# EAGLE design jha_sensor (EAGLE 6.2)
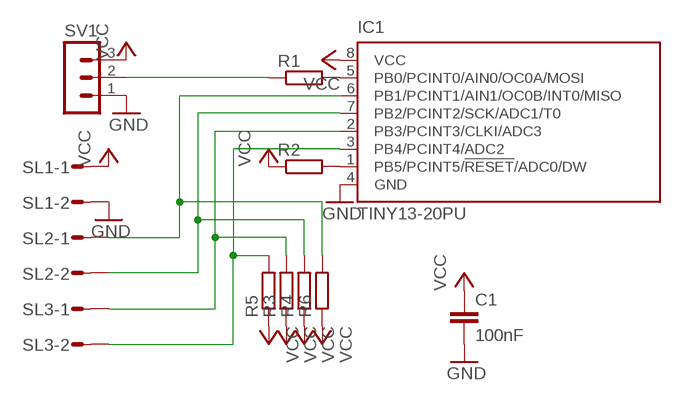
[diagram p0: schematic, sheet 1]

## Parts
C1  100nF  C-EUC0603  [C0603]
IC1  TINY13-20PU  [DIL08]
R1  R-EU_R0805  [R0805]
R2  R-EU_R0805  [R0805]
R3  R-EU_R0805  [R0805]
R4  R-EU_R0805  [R0805]
R5  R-EU_R0805  [R0805]
R6  R-EU_R0805  [R0805]
SL1  MA02S  [02PA]
SL2  MA02S  [02PA]
SL3  MA02S  [02PA]
SV1  MA03-1  [MA03-1]

## Nets
GND: C1.2 IC1.4(GND) SL1.2 SV1.1
N$1: IC1.5(PB0/PCINT0/AIN0/OC0A/MOSI) R1.2
N$2: R1.1 SV1.2
N$3: IC1.1(PB5/PCINT5/!RESET!/ADC0/DW) R2.2
N$4: IC1.2(PB3/PCINT3/CLKI/ADC3) R3.2 SL3.1
N$5: IC1.7(PB2/PCINT2/SCK/ADC1/T0) R4.2 SL2.2
N$6: IC1.6(PB1/PCINT1/AIN1/OC0B/INT0/MISO) R6.2 SL2.1
N$10: IC1.3(PB4/PCINT4/ADC2) R5.2 SL3.2
VCC: C1.1 IC1.8(VCC) R2.1 R3.1 R4.1 R5.1 R6.1 SL1.1 SV1.3

## Library data of the parts
C1 = rcl:C-EU: CAPACITOR, European symbol
IC1 = atmel:TINY13: 8-bit AVR Microcontroller with 1K Bytes In-System Programmable Flash Source: http://www.atmel.com/dyn/resources/prod_documents/2535S.pdf; MPN: ATTINY13-20PU; OC_FARNELL: 9171550; OC_NEWARK: 96K6521
R1-R6 = rcl:R-EU_: RESISTOR, European symbol
SL1-SL3 = con-amp-quick:MA02S: AMP QUICK CONNECTOR; OC_FARNELL: unknown; OC_NEWARK: unknown
SV1 = con-lstb:MA03-1: PIN HEADER; OC_FARNELL: unknown; OC_NEWARK: unknown

## Board
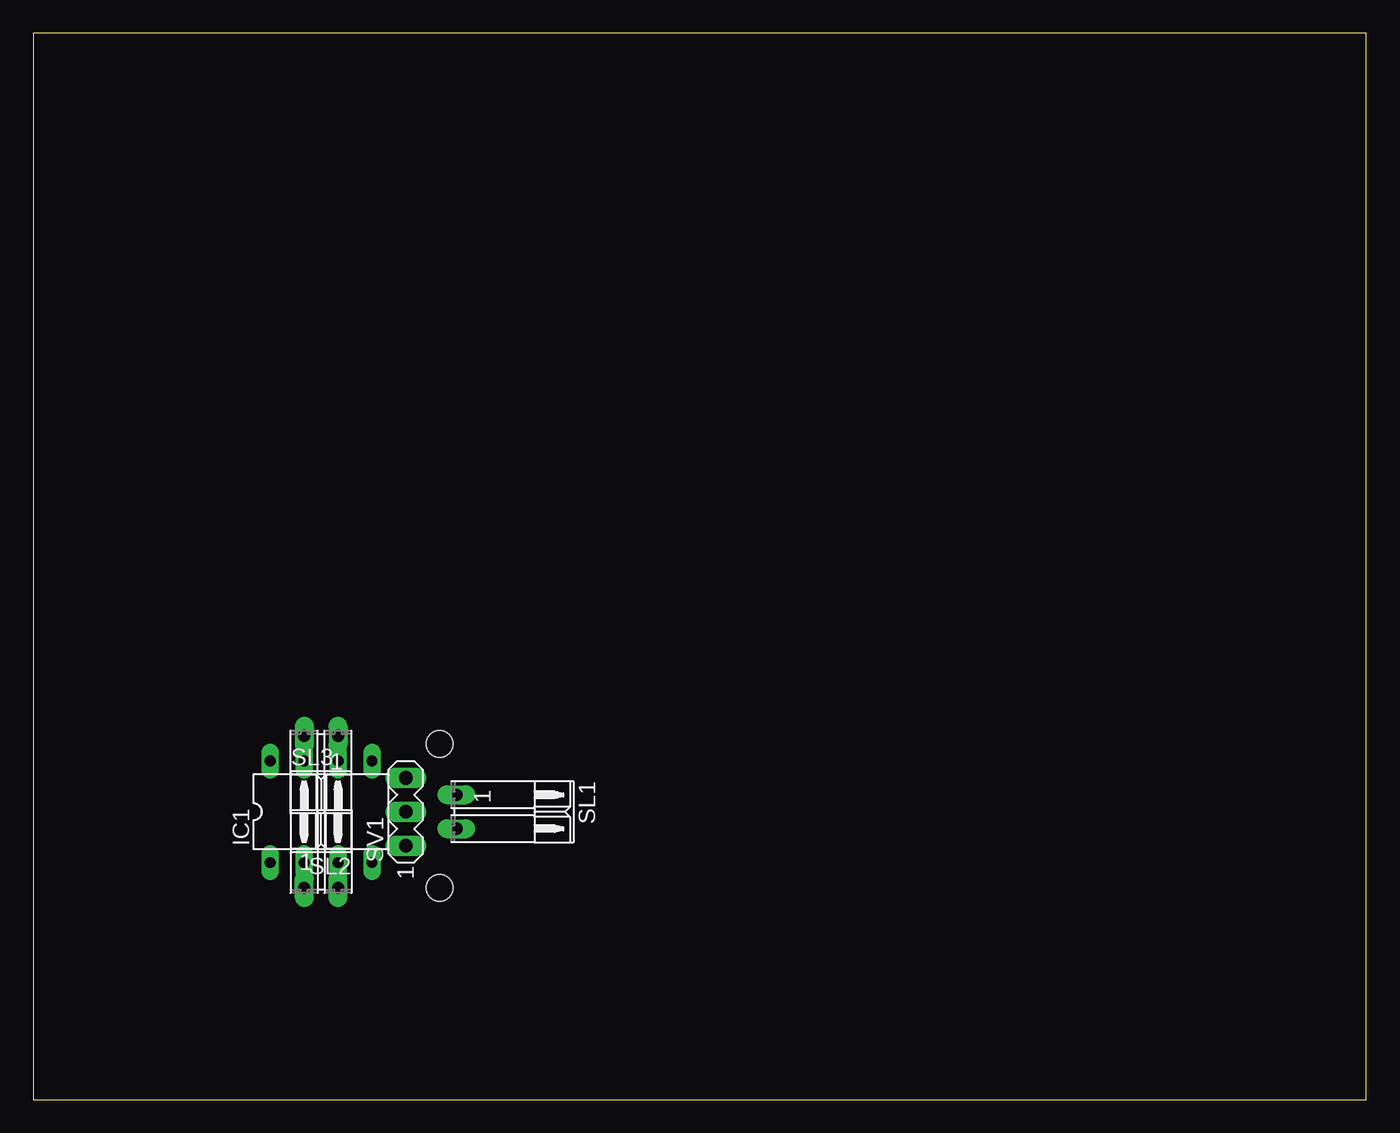
[diagram p1: board, top side]
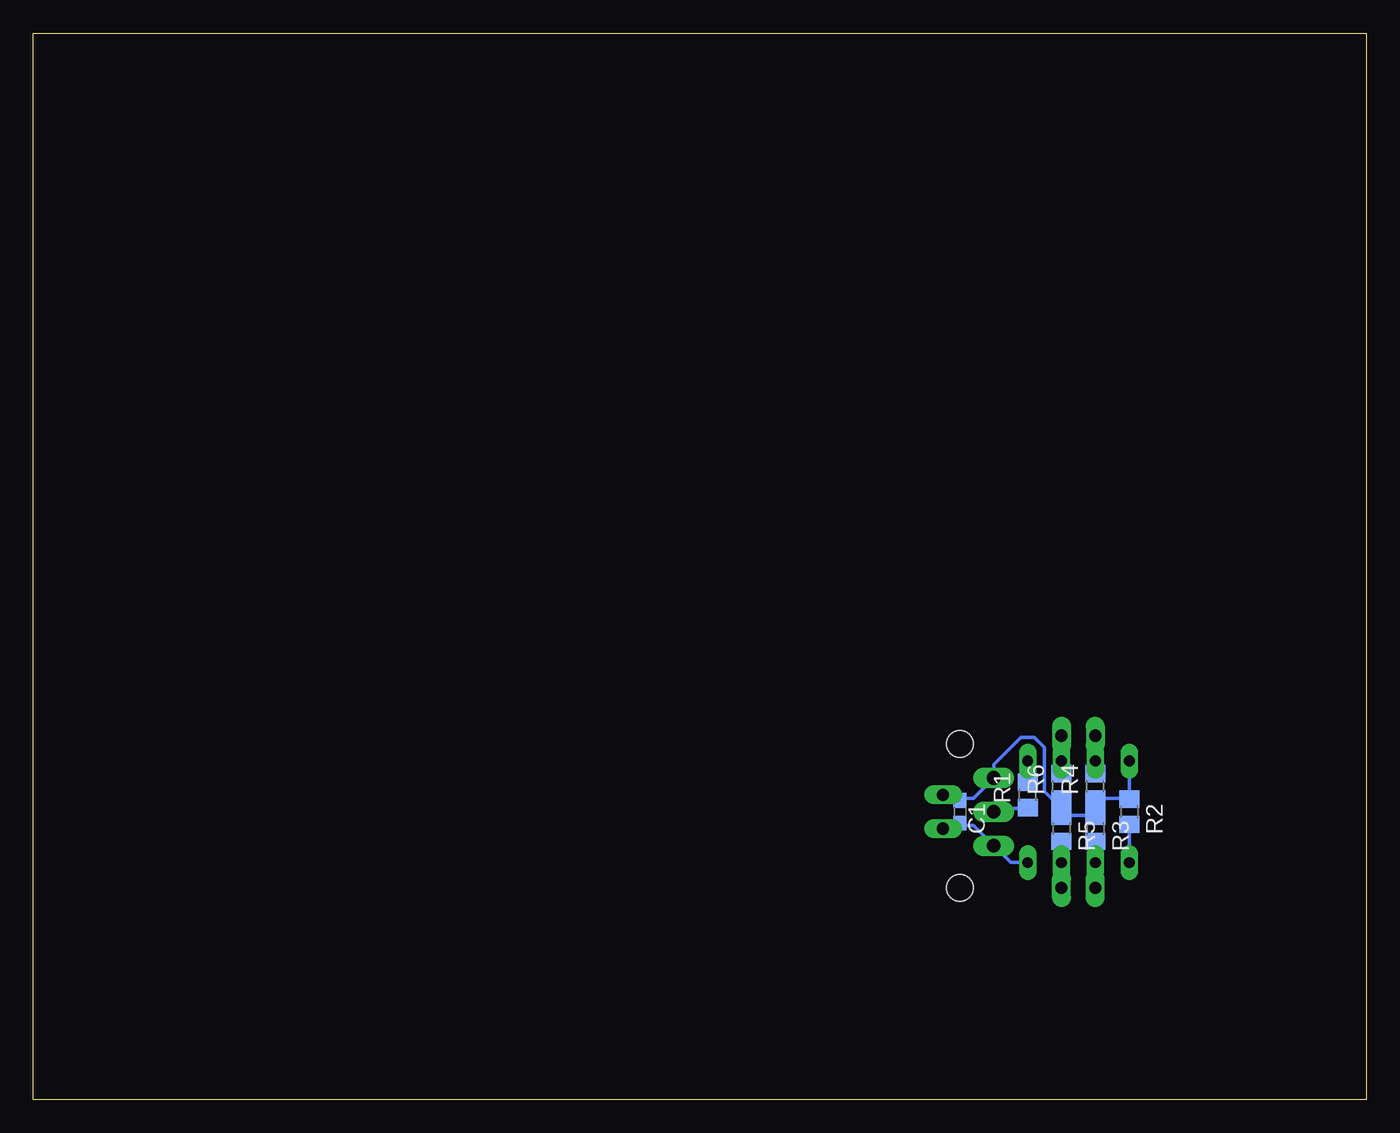
[diagram p2: board, bottom side, seen from below]

Size 100 x 80 mm. Coordinates in mm from the lower left corner, seen from the top.
Outline: 0,0 100,0 100,80 0,80 0,0
Copper layers (1*16): Top 0.035mm / dielectric 1.5mm / Bottom 0.035mm
Design rules: minimum track width 10mil, minimum drill 24mil, track to track 8mil, track to pad 8mil, pad to pad 8mil, via to via 8mil, smd to smd 8mil, copper to edge 40mil, drill to drill 8mil, minimum pad ring 10mil, minimum via ring 8mil, stop-mask expansion 4mil, vias tented up to drill 0mil, thermal gap 10mil
Holes 2 mm at 30.48,26.67 30.48,15.88

### Footprints (pad centres in the part's own frame; a part is rotated, then mirrored left to right if it is on the bottom)
C0603 = smd 1.1 x 1: 1 -0.85,0; 2 0.85,0
DIL08 = drill 0.813 long: 1 -3.81,-3.81; 2 -1.27,-3.81; 3 1.27,-3.81; 4 3.81,-3.81; 5 3.81,3.81; 6 1.27,3.81; 7 -1.27,3.81; 8 -3.81,3.81
R0805 = smd 1.3 x 1.5: 1 -0.95,0; 2 0.95,0
02PA = drill 0.914 long: 1 -1.27,0; 2 1.27,0
MA03-1 = drill 1.016 long: 1 -2.54,0; 2 0,0; 3 2.54,0

### Placement (x,y rotation side)
C1  30.48,21.59 270 bottom
IC1  21.59,21.59 0 top
R1  25.4,22.86 90 bottom
R2  17.78,21.59 270 bottom
R3  20.32,20.32 270 bottom
R4  20.32,23.5 90 bottom
R5  22.86,20.32 270 bottom
R6  22.86,23.5 90 bottom
SL1  31.75,21.59 270 top
SL2  21.59,27.3 180 top
SL3  21.59,15.88 0 top
SV1  27.94,21.59 90 top

### Tracks (layer width: path | path; a pad name or v marks a point on that pad's centre or on a via)
GND
  Bottom 0.254: 30.48,20.57 31.5,20.57 SL1.2 30.48,20.57 | 30.48,20.57 C1.2 | IC1.4 26.67,17.78 SV1.1 29.46,20.57 30.48,20.57
N$1
  Bottom 0.254: IC1.5 R1.2
N$2
  Bottom 0.254: SV1.2 27.69,21.84 25.4,21.84 R1.1
N$3
  Bottom 0.254: IC1.1 R2.2
N$4
  Bottom 0.254: R3.2 IC1.2 SL3.1
N$5
  Bottom 0.254: R4.2 IC1.7 SL2.2
N$6
  Bottom 0.254: R6.2 IC1.6 SL2.1
N$10
  Bottom 0.254: R5.2 IC1.3 SL3.2
VCC
  Bottom 0.254: 30.48,22.61 31.5,22.61 SL1.1 30.48,22.61 | 30.48,22.61 C1.1 | 30.48,22.61 29.46,22.61 SV1.3 27.94,25.15 25.91,27.18 24.89,27.18 24.13,26.42 24.13,23.11 22.86,21.84 | 22.86,21.84 22.86,21.34 | 22.86,21.84 R6.1 | 20.32,21.34 R4.1 20.32,22.61 17.78,22.61 | 20.32,21.34 22.86,21.34 | 20.32,21.34 R3.1 | 17.78,22.61 IC1.8 | 17.78,22.61 R2.1 | 22.86,21.34 R5.1